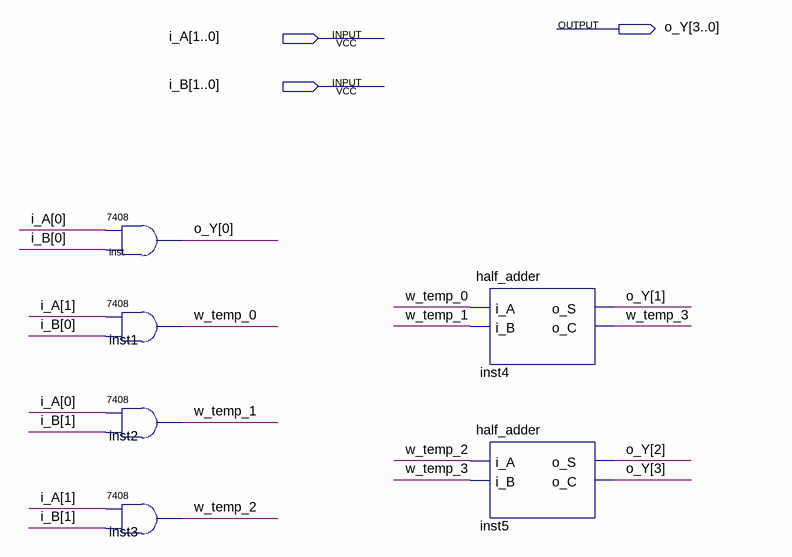
[diagram p0: schematic sheet]
// Quartus schematic mul_2_by_2.bdf as structural Verilog: 6 symbols, 3 pins
module mul_2_by_2 (
  input  [1:0] i_A,
  input  [1:0] i_B,
  output [3:0] o_Y
);

  wire w_temp_0, w_temp_1, w_temp_2, w_temp_3;

  \7408  inst (.\3 (i_B[0]), .\2 (i_A[0]), .\1 (o_Y[0]));
  \7408  inst1 (.\3 (i_B[0]), .\2 (i_A[1]), .\1 (w_temp_0));
  \7408  inst2 (.\3 (i_B[1]), .\2 (i_A[0]), .\1 (w_temp_1));
  \7408  inst3 (.\3 (i_B[1]), .\2 (i_A[1]), .\1 (w_temp_2));
  half_adder inst4 (.i_A(w_temp_0), .i_B(w_temp_1), .o_S(o_Y[1]), .o_C(w_temp_3));
  half_adder inst5 (.i_A(w_temp_2), .i_B(w_temp_3), .o_S(o_Y[2]), .o_C(o_Y[3]));
endmodule
